# Altium schematic sheet Power.SchDoc
size A3; SheetNumber: 1; SheetTotal: 2
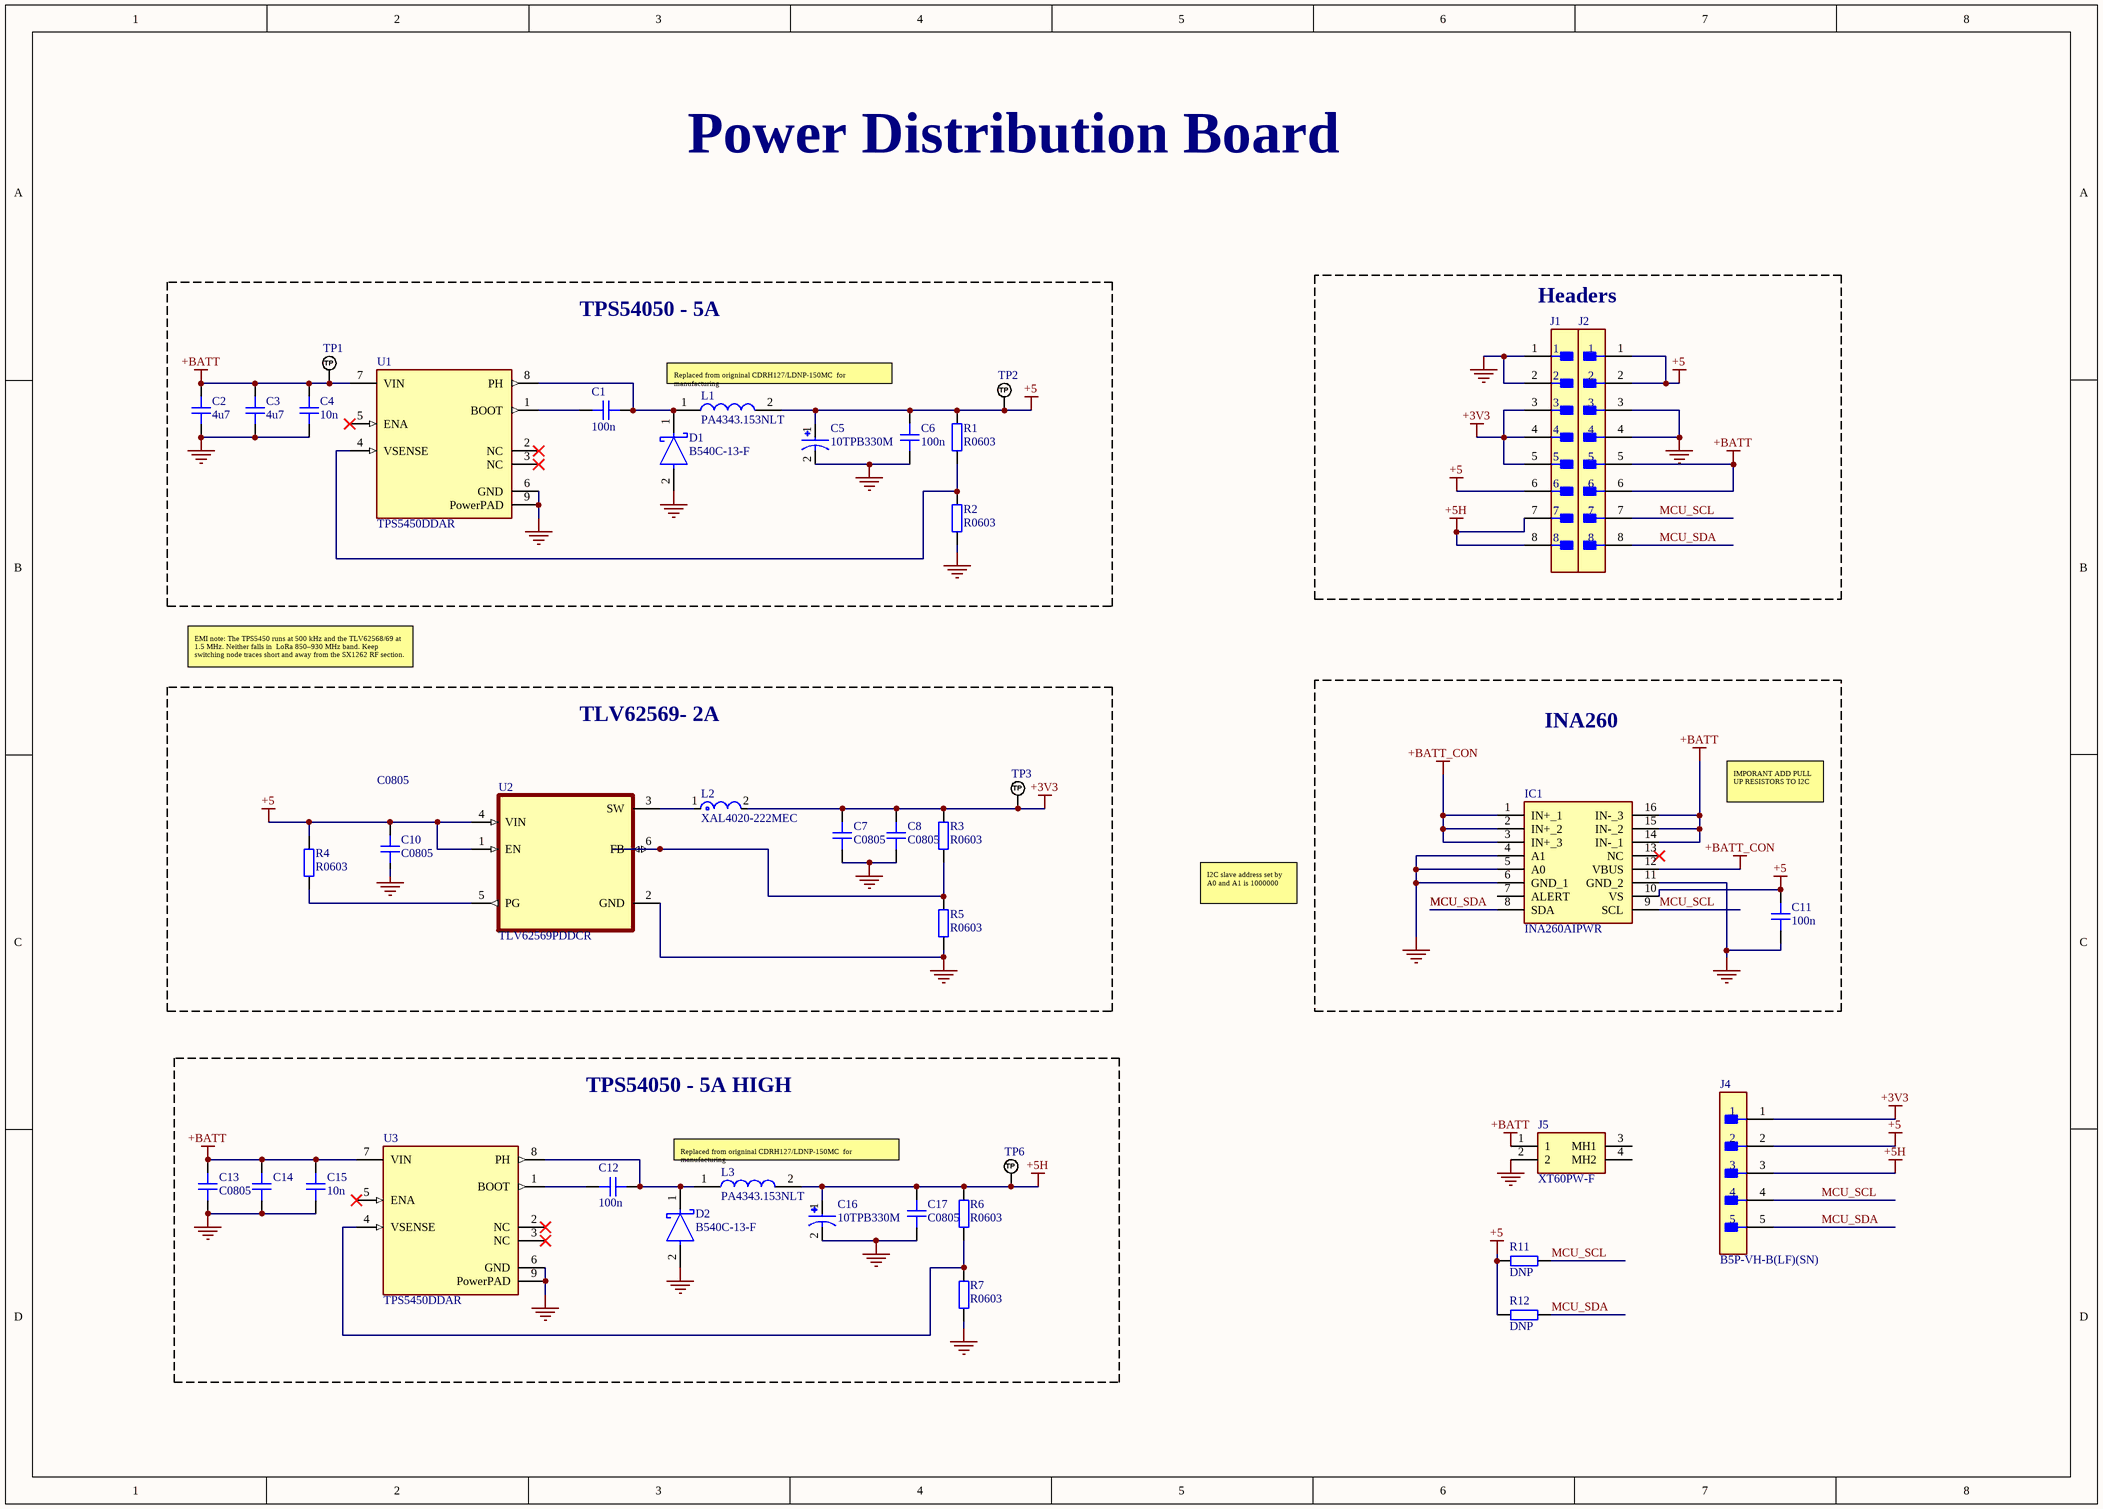
[diagram p0: Power.SchDoc]

## Parts
C1  100n  [CAP_0603]
C2  4u7  [CAP_0805]
C3  4u7  [CAP_0805]
C4  10n  [CAP_0603]
C5  10TPB330M  [CAP_10TPB330M]
C6  100n  [CAP_0805]
C7  C0805  [CAP_0805]
C8  C0805  [CAP_0805]
C10  C0805  [CAP_0805]
C11  100n  [CAP_0603]
C12  100n  [CAP_0603]
C13  C0805  [CAP_0805]
C14  C0805  [CAP_0805]
C15  10n  [CAP_0603]
C16  10TPB330M  [CAP_10TPB330M]
C17  C0805  [CAP_0805]
D1  B540C-13-F  [FP-SMC-MFG]
D2  B540C-13-F  [FP-SMC-MFG]
IC1  INA260AIPWR  [SOP65P640X120-16N]
J1  TSW-108-08-G-S  [FP-TSW-108-08-G-S-MFG]  (value not drawn)
J2  TSW-108-08-G-S  [FP-TSW-108-08-G-S-MFG]  (value not drawn)
J4  B5P-VH-B(LF)(SN)  [FP-B5P-VH-B_LF_SN-MFG]
J5  XT60PW-F  [XT60PWF]
L1  PA4343.153NLT  [INDPM140128X650N]
L2  XAL4020-222MEC  [FP-XAL4020-MFG]
L3  PA4343.153NLT  [INDPM140128X650N]
R1  R0603  [RES_0603]
R2  R0603  [RES_0603]
R3  R0603  [RES_0603]
R4  R0603  [RES_0603]
R5  R0603  [RES_0603]
R6  R0603  [RES_0603]
R7  R0603  [RES_0603]
R11  DNP  [RES_0402]
R12  DNP  [RES_0402]
TP1  TEST_POINT_RND_1MM  [PAD_RND_1MM]  (value not drawn)  (no BOM)
TP2  TEST_POINT_RND_1MM  [PAD_RND_1MM]  (value not drawn)  (no BOM)
TP3  TEST_POINT_RND_1MM  [PAD_RND_1MM]  (value not drawn)  (no BOM)
TP6  TEST_POINT_RND_1MM  [PAD_RND_1MM]  (value not drawn)  (no BOM)
U1  TPS5450DDAR  [FP-DDA0008J-MFG]
U2  TLV62569PDDCR  [SOT95P280X110-6N]
U3  TPS5450DDAR  [FP-DDA0008J-MFG]

## Blocks framed on the sheet
TPS54050 - 5A: C1-C6 D1 L1 R1 R2 TP1 TP2 U1
Headers: J1 J2
TLV62569- 2A: C7 C8 C10 L2 R3-R5 TP3 U2
INA260: C11 IC1
TPS54050 - 5A HIGH: C12-C17 D2 L3 R6 R7 TP6 U3

## Nets
+3V3: C7.1 C8.1 J1.3 J1.4 J1.5 J4.1 L2.2 R3.2 TP3.1(TP)
+5: C5.1 C6.1 C10.1 C11.2 IC1.10(VS) J1.6 J2.1 J2.2 J4.2 L1.2 R1.2 R4.2 R11.1 R12.1 TP2.1(TP) U2.1(EN) U2.4(VIN)
+5H: C16.1 C17.1 J1.7 J1.8 J4.3 L3.2 R6.2 TP6.1(TP)
+BATT: C2.1 C3.1 C4.2 C13.1 C14.1 C15.2 IC1.14(IN-_1) IC1.15(IN-_2) IC1.16(IN-_3) J2.5 J2.6 J5.1 TP1.1(TP) U1.7(VIN) U3.7(VIN)
+BATT_CON: IC1.1(IN+_1) IC1.2(IN+_2) IC1.3(IN+_3) IC1.12(VBUS)
GND: C2.2 C3.2 C4.1 C5.2 C6.2 C7.2 C8.2 C10.2 C11.1 C13.2 C14.2 C15.1 C16.2 C17.2 D1.2(A) D2.2(A) IC1.4(A1) IC1.5(A0) IC1.6(GND_1) IC1.11(GND_2) J1.1 J1.2 J2.3 J2.4 J5.2 R2.1 R5.1 R7.1 U1.6(GND) U1.9(PowerPAD) U2.2(GND) U3.6(GND) U3.9(PowerPAD)
MCU_: IC1.8(SDA) J2.8 J4.5 R12.2  [also labelled MCU_SDA]
MCU_SCL: IC1.9(SCL) J2.7 J4.4 R11.2
NetC1_1: C1.1 D1.1(C) L1.1 U1.8(PH)
NetC1_2: C1.2 U1.1(BOOT)
NetC12_1: C12.1 D2.1(C) L3.1 U3.8(PH)
NetC12_2: C12.2 U3.1(BOOT)
NetL2_1: L2.1 U2.3(SW)
NetR1_1: R1.1 R2.2 U1.4(VSENSE)
NetR3_1: R3.1 R5.2 U2.6(FB)
NetR4_1: R4.1 U2.5(PG)
NetR6_1: R6.1 R7.2 U3.4(VSENSE)

Not connected (* = marked no-connect by the designer): IC1 7(ALERT) 13(NC)*; J5 3(MH1) 4(MH2); U1 2(NC)* 3(NC)* 5(ENA)*; U3 2(NC)* 3(NC)* 5(ENA)*

## Notes on the sheet
- Power Distribution Board
- Replaced from origninal CDRH127/LDNP-150MC  for manufacturing
- EMI note: The TPS5450 runs at 500 kHz and the TLV62568/69 at 1.5 MHz. Neither falls in  LoRa 850–930 MHz band. Keep switching node traces short and away from the SX1262 RF section.
- IMPORANT ADD PULL UP RESISTORS TO I2C
- I2C slave address set by A0 and A1 is 1000000

## Library data of the parts
C1 C4 C11 C12 C15 = CAP_0603: Capacitor SMD 0603; Manufacturer: *; Manufacturer Part Number: *; Distributor Link: *; LCSC: *; Rating: *; Dielectric: *
C2 C3 C6-C8 C10 C13 C14 C17 = CAP_0805: Capacitor SMD 0805; Manufacturer: *; Manufacturer Part Number: *; Distributor Link: *; LCSC: *; Rating: *; Dielectric: *
D1 D2 = CMP-2000-05097-3: DIODE SCHOTTKY 40V 5A SMC; Manufacturer: Diodes Inc.; Automotive Grade: NA; Peak Reverse Current: 0.5mA; Value: 300pF; Max Junction Temp: +150°C; Max Surge Forward Current: 100A; Standoff Height: 0.1mm; Digikey Description: DIODE SCHOTTKY 40V 5A SMC; Temperature Range Low: -55°C; Manufacturer Part Number: B540C-13-F; Octopart: https://octopart.com/b540c-13-f-diodes+inc.-325873; Lead Free: Yes; Reverse Voltage: 40V; RoHS: TRUE; Category: Diode; Mouser Description: Diode: Schottky rectifying; SMD; 40V; 5A; SMC; Package: reel, tape; ComponentLink2Description: Datasheet; Temperature Range High: +150°C; Automotive: No; Footprint Url: https://www.diodes.com/assets/Package-Files/SMC.pdf; Device Class L3: Schottky Diodes; Height: 2.5mm; Forward Current: 5A; Temperature: -55°C to +150°C; Package: SMC; ComponentLink2URL: https://www.diodes.com/assets/Datasheets/ds13012.pdf; Device Class L2: Diodes; Max Repetitive Reverse Voltage: 40V; Device Class L1: Discrete Semiconductors; Capacitance: 300pF
IC1 = INA260AIPWR: Integrated Circuit; Manufacturer_Name: Texas Instruments; Datasheet Link: http://www.ti.com/lit/gpn/INA260; Height: 1.2mm; Manufacturer_Part_Number: INA260AIPWR; Mouser Part Number: 595-INA260AIPWR; Mouser Price/Stock: https://www.mouser.co.uk/ProductDetail/Texas-Instruments/INA260AIPWR?qs=vcbl%252BK4rRldNzXQDYx03SQ%3D%3D; Arrow Part Number: INA260AIPWR; Arrow Price/Stock: https://www.arrow.com/en/products/ina260aipwr/texas-instruments.html?utm_currency=USD&region=nac
J1 J2 = CMP-02766-000001-1: CONN HEADER VERT 8POS 2.54MM; Manufacturer: Samtec; Number Of Contacts: 8; Conn Orientation: Straight; Conn Gender: Male; Device Class L1: Connectors; ComponentLink2Description: Datasheet; Digikey Description: CONN HEADER VERT 8POS 2.54MM; ComponentLink2URL: http://suddendocs.samtec.com/catalog_english/tsw_th.pdf; Temperature: -55°C to +125°C; RoHS: TRUE; Mouser Description: TSW - Samtec 2.54mm Pin Header 13.46mm Overall Pin Length 5.08mm Tail; Automotive: No; Temperature Range High: +125°C; Package: TSW-108-08-G-S; Device Class L3: unset; Manufacturer Part Number: TSW-108-08-G-S; Pitch: 2.54mm; Number Of Rows: 1; Lead Free: Yes; Height: 8.71mm; Contact Material: Gold,Nickel; Footprint Url: http://suddendocs.samtec.com/prints/tsw-xxx-xx-x-x-xx-xxx-footprint.pdf; Temperature Range Low: -55°C; Octopart: https://octopart.com/tsw-108-08-g-s-samtec-272653; Category: Conn; Device Class L2: Headers and Wire Housings
J4 = CMP-17439-000483-1: CONN HEADER VERT 5POS 3.96MM; Contact Resistance: 20mR; Number of Positions: 5; Max Current Rating: 10A; Voltage Rating: 250V; Min Operating Temperature: -25°C; Fastening Type: Ramp; Max Operating Temperature: 85°C; Series: VH; Contact Finish - Mating: TIN; Depth: 8.5mm; Insulation Color: Natural; Length: 19.74mm; Number of Rows: 1; Flammability Rating: UL94 V-0; Orientation: Straight; Packaging: Bulk; Lead Free: Lead Free; Pitch: 3.96mm; Contact Material: Brass; Connector Type: Header; Housing Color: White; Contact Plating: Copper; Number of Pins: 5; Contact Shape: Square; Insulation Material: PBT; Max Voltage Rating (AC): 250V; Contact Type: Male Pin; Color: White; Termination: Solder
J5 = XT60PW-F: Connector; Manufacturer_Name: Amass; Datasheet Link: https://www.tme.eu/Document/1191bc2fa3aee3c446e5a895fd8f7983/XT60PW-F.pdf; Height: 8.4mm; Manufacturer_Part_Number: XT60PW-F
L1 L3 = PA4343.153NLT: Inductor; Manufacturer_Name: Yageo Group; Datasheet Link: https://datasheet.datasheetarchive.com/originals/distributors/DKDS-10/182394.pdf; Height: 6.5mm; Manufacturer_Part_Number: PA4343.153NLT; Mouser Part Number: 673-PA4343.153NLT; Mouser Price/Stock: https://www.mouser.co.uk/ProductDetail/Pulse-Electronics/PA4343153NLT?qs=%2FzQKu7YvIMa1YhPbm59etw%3D%3D; Arrow Part Number: PA4343.153NLT; Arrow Price/Stock: https://www.arrow.com/en/products/pa4343.153nlt/pulse-electronics-corporation
L2 = CMP-11268-000134-1: Fixed Inductors 2.2uH Shld 20% 5.5A 38.7mOhms AECQ2; Saturation Current: 5.6A; Core Material: Composite; DC Resistance (DCR): 38.7mR; Self Resonant Frequency: 52MHz; Test Frequency: 100kHz; Shielding: Shielded; Length: 4.3mm; Tolerance: 20%; Packaging: Tape and Reel; Height: 2.1mm; Mount: Surface Mount; Termination: SMD/SMT; Lead Free: Contains Lead; Package Quantity: 1000; Inductance: 2.2uH; Series: XAL4020; Min Operating Temperature: -40°C; Max DC Current: 5.5A; Max Operating Temperature: 125°C; Case/Package: SMD/SMT; Inductance Tolerance: 20%; RMS Current (Irms): 5.5A; Width: 4.3mm; RoHS Compliant: Yes
R1-R7 = RES_0603: Resistor SMD 0603; Manufacturer: *; Manufacturer Part Number: *; Distributor Link: *; LCSC: *
R11 R12 = RES_0402: Resistor SMD 0402; Manufacturer: *; Manufacturer Part Number: *; Distributor Link: *; LCSC: *
TP1-TP3 TP6 = CMP-019-000001-1: Test Point Round 1mm (NO BOM); Design Item ID: TEST_POINT_RND_1MM; Source: Schematic-Lib-PhilsLab.SchLib
U1 U3 = CMP-04918-000100-1: IC REG BUCK ADJUSTABLE 5A 8SOPWR; Manufacturer: Texas Instruments; Output Type: AdjustableProgrammable; Output Voltage: 1.22-31V; Max Duty Cycle: 89%; Min Supply Voltage: 5.5V; Standoff Height: 0mm; Max Junction Temp: +125°C; Max Supply Voltage: 36V; Nominal Supply Current: 3mA; Number Of Outputs: 1; Switching Frequency: 500kHz; Device Class L3: Voltage Regulators - Switching; Octopart: https://octopart.com/tps5450ddar-texas+instruments-7105511; Temperature: -40°C to +125°C; Mouser Description: Conv DC-DC 5.5V to 36V Step Down Single-Out 1.22V to 31V 5A 8-Pin HSOP EP T/R; Device Class L1: Integrated Circuits (ICs); ComponentLink2URL: https://www.ti.com/lit/ds/symlink/tps5450.pdf; Automotive: No; Package: DDA0008J; ComponentLink2Description: Datasheet; Temperature Range Low: -40°C; RoHS: TRUE; Digikey Description: IC REG BUCK ADJUSTABLE 5A 8SOPWR; Lead Free: Yes; Manufacturer Part Number: TPS5450DDAR; Device Class L2: Power Management ICs; Temperature Range High: +125°C; Output Current: 5A; Height: 1.7mm; Ipc Land Pattern Name: SOIC127P600X170-8; Category: IC; Switching Topology: Buck
U2 = TLV62569PDDCR: 2.5V-5.5V input, 2-A high efficiency step-down buck converter in SOT23 and SOT563 package; MF: Texas Instruments; SnapEDA_Link: https://www.snapeda.com/parts/TLV62569PDDCR/Texas+Instruments/view-part/?ref=snap; Package: SOT-23-THN-6 Texas Instruments; Value: *; MP: TLV62569PDDCR; Check_prices: https://www.snapeda.com/parts/TLV62569PDDCR/Texas+Instruments/view-part/?ref=eda
C5 C16 = 10TPB330M: Price: None; Availability: Unavailable; MP: 10TPB330M; Value: *; Package: None